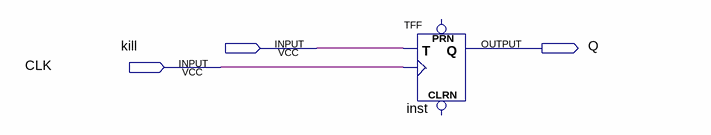
[diagram p0: schematic sheet]
// Quartus schematic test.bdf as structural Verilog: 1 symbols, 3 pins
module test (
  input  kill,
  input  CLK,
  output Q
);

  TFF inst (.T(kill), .CLK(CLK), .Q(Q));  // open: PRN, CLRN
endmodule
